# Altium schematic sheet Embedded_System_Top.SchDoc
size A
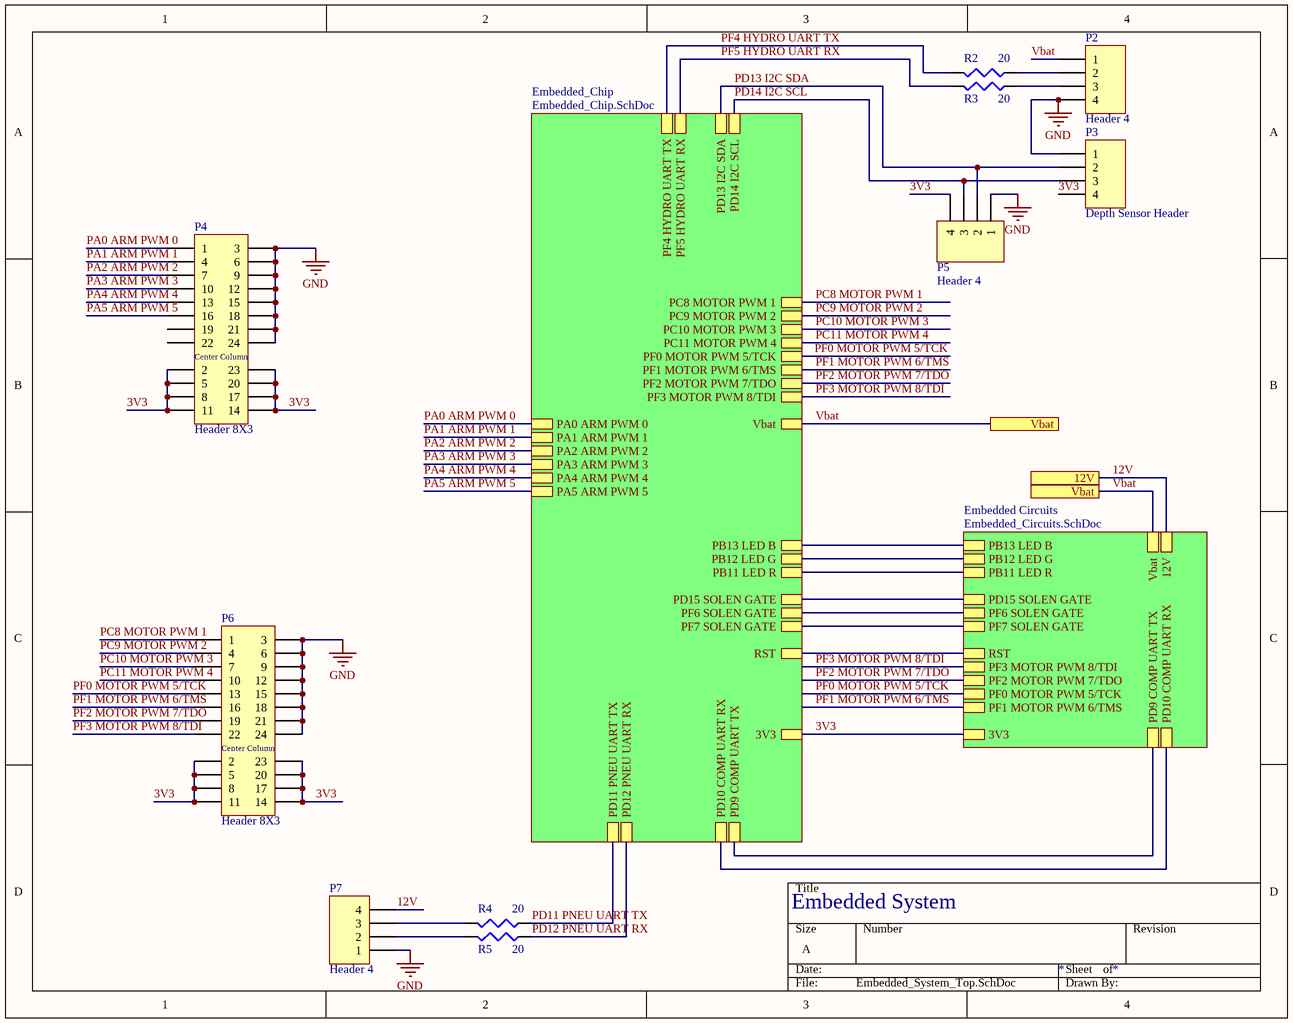
[diagram p0: Embedded_System_Top.SchDoc]

## Parts
P2  Header 4  [Header 1x4]
P3  Depth Sensor Header  [DF13-4P-1.25DSA]
P4  Header 8X3  [Header 8X3]
P5  Header 4  [DF13-4P-1.25DSA]
P6  Header 8X3  [Header 8X3]
P7  Header 4  [Header 1x4]
R2  value 20  [J1-0603]  (hidden comment: Res3)
R3  value 20  [J1-0603]  (hidden comment: Res3)
R4  value 20  [J1-0603]  (hidden comment: Res3)
R5  value 20  [J1-0603]  (hidden comment: Res3)

## Sub-sheets
Embedded Circuits = Embedded_Circuits.SchDoc: 3V3, RST, PB11 LED R, PB12 LED G, PB13 LED B, PF3 MOTOR PWM 8/TDI, PF2 MOTOR PWM 7/TDO, PF0 MOTOR PWM 5/TCK, PF1 MOTOR PWM 6/TMS, PD10 COMP UART RX, PD9 COMP UART TX, Vbat, 12V, PD15 SOLEN GATE, PF6 SOLEN GATE, PF7 SOLEN GATE
Embedded_Chip = Embedded_Chip.SchDoc: 3V3, RST, PB11 LED R, PB13 LED B, PB12 LED G, PD10 COMP UART RX, PD9 COMP UART TX, Vbat, PF3 MOTOR PWM 8/TDI, PF2 MOTOR PWM 7/TDO, PF1 MOTOR PWM 6/TMS, PF0 MOTOR PWM 5/TCK, PC11 MOTOR PWM 4, PC10 MOTOR PWM 3, PC9 MOTOR PWM 2, PC8 MOTOR PWM 1, PF5 HYDRO UART RX, PF4 HYDRO UART TX, PD11 PNEU UART TX, PD12 PNEU UART RX, PA3 ARM PWM 3, PA1 ARM PWM 1, PA2 ARM PWM 2, PA0 ARM PWM 0, PA4 ARM PWM 4, PA5 ARM PWM 5, PD13 I2C SDA, PD14 I2C SCL, PD15 SOLEN GATE, PF6 SOLEN GATE, PF7 SOLEN GATE

## Ports
12V, Vbat

## Nets
GND: P2.4 P3.1 P4.3 P4.6 P4.9 P4.12 P4.15 P4.18 P4.21 P4.24 P5.1 P6.3 P6.6 P6.9 P6.12 P6.15 P6.18 P6.21 P6.24 P7.1
3V3: P3.4 P4.2 P4.5 P4.8 P4.11 P4.14 P4.17 P4.20 P4.23 P5.4 P6.2 P6.5 P6.8 P6.11 P6.14 P6.17 P6.20 P6.23 ; sheet Embedded_Chip/3V3, sheet Embedded Circuits/3V3
12V: P7.4 ; port 12V, sheet Embedded Circuits/12V
PA0 ARM PWM 0: P4.1 ; sheet Embedded_Chip/PA0 ARM PWM 0
PA1 ARM PWM 1: P4.4 ; sheet Embedded_Chip/PA1 ARM PWM 1
PA2 ARM PWM 2: P4.7 ; sheet Embedded_Chip/PA2 ARM PWM 2
PA3 ARM PWM 3: P4.10 ; sheet Embedded_Chip/PA3 ARM PWM 3
PA4 ARM PWM 4: P4.13 ; sheet Embedded_Chip/PA4 ARM PWM 4
PA5 ARM PWM 5: P4.16 ; sheet Embedded_Chip/PA5 ARM PWM 5
PC8 MOTOR PWM 1: P6.1 ; sheet Embedded_Chip/PC8 MOTOR PWM 1
PC9 MOTOR PWM 2: P6.4 ; sheet Embedded_Chip/PC9 MOTOR PWM 2
PC10 MOTOR PWM 3: P6.7 ; sheet Embedded_Chip/PC10 MOTOR PWM 3
PC11 MOTOR PWM 4: P6.10 ; sheet Embedded_Chip/PC11 MOTOR PWM 4
PD11 PNEU UART TX: R4.1 ; sheet Embedded_Chip/PD11 PNEU UART TX
PD12 PNEU UART RX: R5.1 ; sheet Embedded_Chip/PD12 PNEU UART RX
PD13 I2C SDA: P3.2 P5.2 ; sheet Embedded_Chip/PD13 I2C SDA
PD14 I2C SCL: P3.3 P5.3 ; sheet Embedded_Chip/PD14 I2C SCL
PF0 MOTOR PWM 5/TCK: P6.13 ; sheet Embedded_Chip/PF0 MOTOR PWM 5/TCK, sheet Embedded Circuits/PF0 MOTOR PWM 5/TCK
PF1 MOTOR PWM 6/TMS: P6.16 ; sheet Embedded_Chip/PF1 MOTOR PWM 6/TMS, sheet Embedded Circuits/PF1 MOTOR PWM 6/TMS
PF2 MOTOR PWM 7/TDO: P6.19 ; sheet Embedded_Chip/PF2 MOTOR PWM 7/TDO, sheet Embedded Circuits/PF2 MOTOR PWM 7/TDO
PF3 MOTOR PWM 8/TDI: P6.22 ; sheet Embedded_Chip/PF3 MOTOR PWM 8/TDI, sheet Embedded Circuits/PF3 MOTOR PWM 8/TDI
PF4 HYDRO UART TX: R2.2 ; sheet Embedded_Chip/PF4 HYDRO UART TX
PF5 HYDRO UART RX: R3.2 ; sheet Embedded_Chip/PF5 HYDRO UART RX
Vbat: P2.1 ; port Vbat, sheet Embedded_Chip/Vbat, sheet Embedded Circuits/Vbat
NetP2_2: P2.2 R2.1
NetP2_3: P2.3 R3.1
NetP7_2: P7.2 R5.2
NetP7_3: P7.3 R4.2
(unnamed): sheet Embedded_Chip/RST, sheet Embedded Circuits/RST
(unnamed): sheet Embedded_Chip/PB11 LED R, sheet Embedded Circuits/PB11 LED R
(unnamed): sheet Embedded_Chip/PB13 LED B, sheet Embedded Circuits/PB13 LED B
(unnamed): sheet Embedded_Chip/PB12 LED G, sheet Embedded Circuits/PB12 LED G
(unnamed): sheet Embedded_Chip/PD10 COMP UART RX, sheet Embedded Circuits/PD10 COMP UART RX
(unnamed): sheet Embedded_Chip/PD9 COMP UART TX, sheet Embedded Circuits/PD9 COMP UART TX
(unnamed): sheet Embedded_Chip/PD15 SOLEN GATE, sheet Embedded Circuits/PD15 SOLEN GATE
(unnamed): sheet Embedded_Chip/PF6 SOLEN GATE, sheet Embedded Circuits/PF6 SOLEN GATE
(unnamed): sheet Embedded_Chip/PF7 SOLEN GATE, sheet Embedded Circuits/PF7 SOLEN GATE

Not connected (* = marked no-connect by the designer): P4 19 22

## Notes on the sheet
- Embedded System
- (in symbol Header 8X3 (2mm)) Center Column

## Library data of the parts
P2 P3 P5 P7 = Header 4: Header, 4-Pin; LatestRevisionDate: 17-Jul-2002; LatestRevisionNote: Re-released for DXP Platform.; Publisher: Altium Limited
P4 P6 = Header 8X3 (2mm): Connector Header Through Hole 24 position 0.079" (2.00mm); Digikey: https://www.digikey.com/product-detail/en/samtec-inc/TMMH-108-01-T-T/SAM12190-ND/6692344; Drawing: http://suddendocs.samtec.com/prints/tmmh-1xx-xx-xx-x-xxx-mkt.pdf
R2-R5 = Res3: Resistor; Published: 8-Jun-2000; LatestRevisionDate: 29-May-2009; LatestRevisionNote: IPC-7351 Footprint Added.; PackageReference: J1-0603; Publisher: Altium Limited; PackageDescription: Chip Resistor